# Altium schematic sheet UI.SchDoc
size A3; SheetNumber: 8; SheetTotal: 11
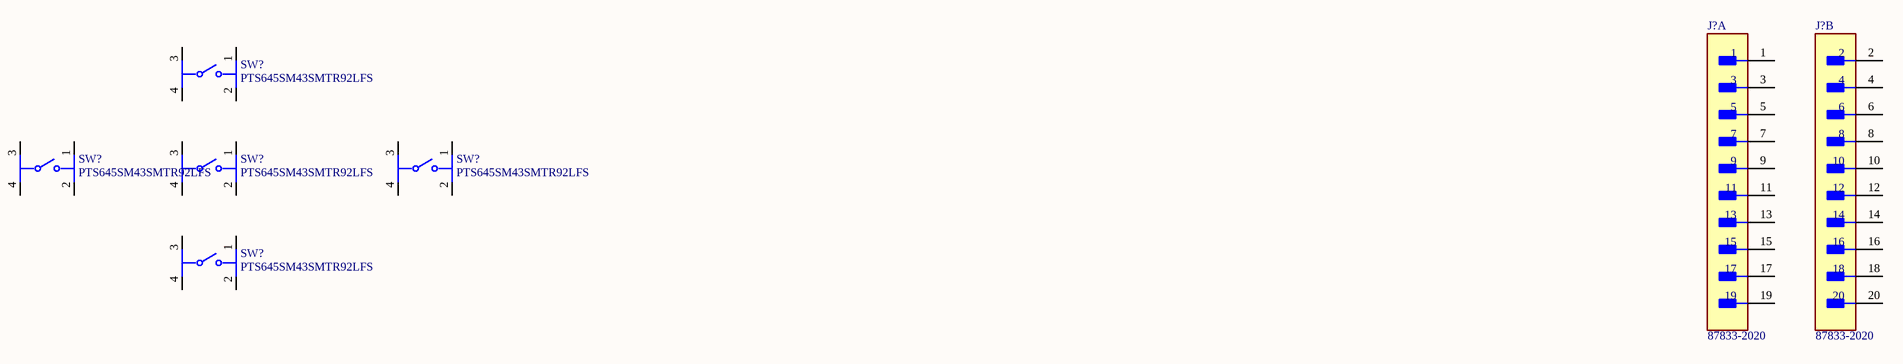
[diagram p0: UI.SchDoc]

## Parts
(Parts that share a designator on the sheet are numbered #1, #2 ... from top to bottom, then left to right.)
J?#1  87833-2020  [FP-87833-2020-MFG]  (part A of 2)
J?#2  87833-2020  [FP-87833-2020-MFG]  (part B of 2)
SW?#1  PTS645SM43SMTR92LFS  [FP-PTS645SM43SMTR92LFS-MFG]
SW?#2  PTS645SM43SMTR92LFS  [FP-PTS645SM43SMTR92LFS-MFG]
SW?#3  PTS645SM43SMTR92LFS  [FP-PTS645SM43SMTR92LFS-MFG]
SW?#4  PTS645SM43SMTR92LFS  [FP-PTS645SM43SMTR92LFS-MFG]
SW?#5  PTS645SM43SMTR92LFS  [FP-PTS645SM43SMTR92LFS-MFG]

## Nets

Not connected (* = marked no-connect by the designer): J?#1 1 3 5 7 9 11 13 15 17 19; J?#2 2 4 6 8 10 12 14 16 18 20; SW?#1 1 2 3 4; SW?#2 1 2 3 4; SW?#3 1 2 3 4; SW?#4 1 2 3 4; SW?#5 1 2 3 4

## Library data of the parts
J?#1 J?#2 = CMP-00257-00277225-1: 87833-2020 Conn Shrouded Header (4 Sides) HDR 20 POS 2mm Solder RA Side Entry Thru-Hole Milli-Grid™ Tube; NexarPartId: 277225; Shrouded: Yes RoHS Compliant: Yes; Glow Wire Compliant: Non-compliant; Gender: Male; Number of Contacts: 20; Insulation Resistance: 1GΩ; Voltage Rating: 125V; Current Rating: 2A; Number of Rows: 2; Housing Color: Black; Orientation: Right Angle; RoHS: Compliant; Lead Pitch: 2mm; Flammability Rating: UL94 V-0; Contact Gender: Male; Min Operating Temperature: -55°C; Number of Circuits: 20; Max Operating Temperature: 105°C; Lead Free: Lead Free; Color: Black; Housing Material: Thermoplastic; Contact Plating: Gold; Number of Positions: 20; Row Spacing: 2mm; Termination: Solder; Contact Material: Brass; Mount: Through Hole; Height: 6.5mm; Voltage Rating (DC): 125V; Radiation Hardening: No; Pitch: 2mm; Schedule B: 8536694040
SW?#1-SW?#5 = CMP-2000-05160-2: SWITCH TACTILE SPST-NO 0.05A 12V; Contact Resistance: 100mR; Throw Configuration: SPST; Illumination Type: Non-Illuminated; Mechanical Life: 100000Cycles; Current Rating: 50mA; Switch Function: Off-Mom; Actuator Length: 0.85mm; Actuator Material: Nylon; Actuator Type: Standard; Operating Force: 160gf; Min Operating Temperature: -20°C; REACH SVHC: No SVHC; Termination: Gull Wing; Case/Package: SMD/SMT; Packaging: Tape and Reel; Mount: Surface Mount; Voltage Rating (DC): 12V; Orientation: Straight; Lead Free: Lead Free; Contact Material: Silver; Color: Black; Max Current Rating: 50mA; Contact Plating: Silver; Depth: 9mm; Package Quantity: 1; Max Voltage Rating (DC): 12V; Length: 6mm; Max Operating Temperature: 60°C